# Altium schematic sheet Power.SchDoc: Power
size A3; Author: Silard Gal; SheetNumber: 3; SheetTotal: 7
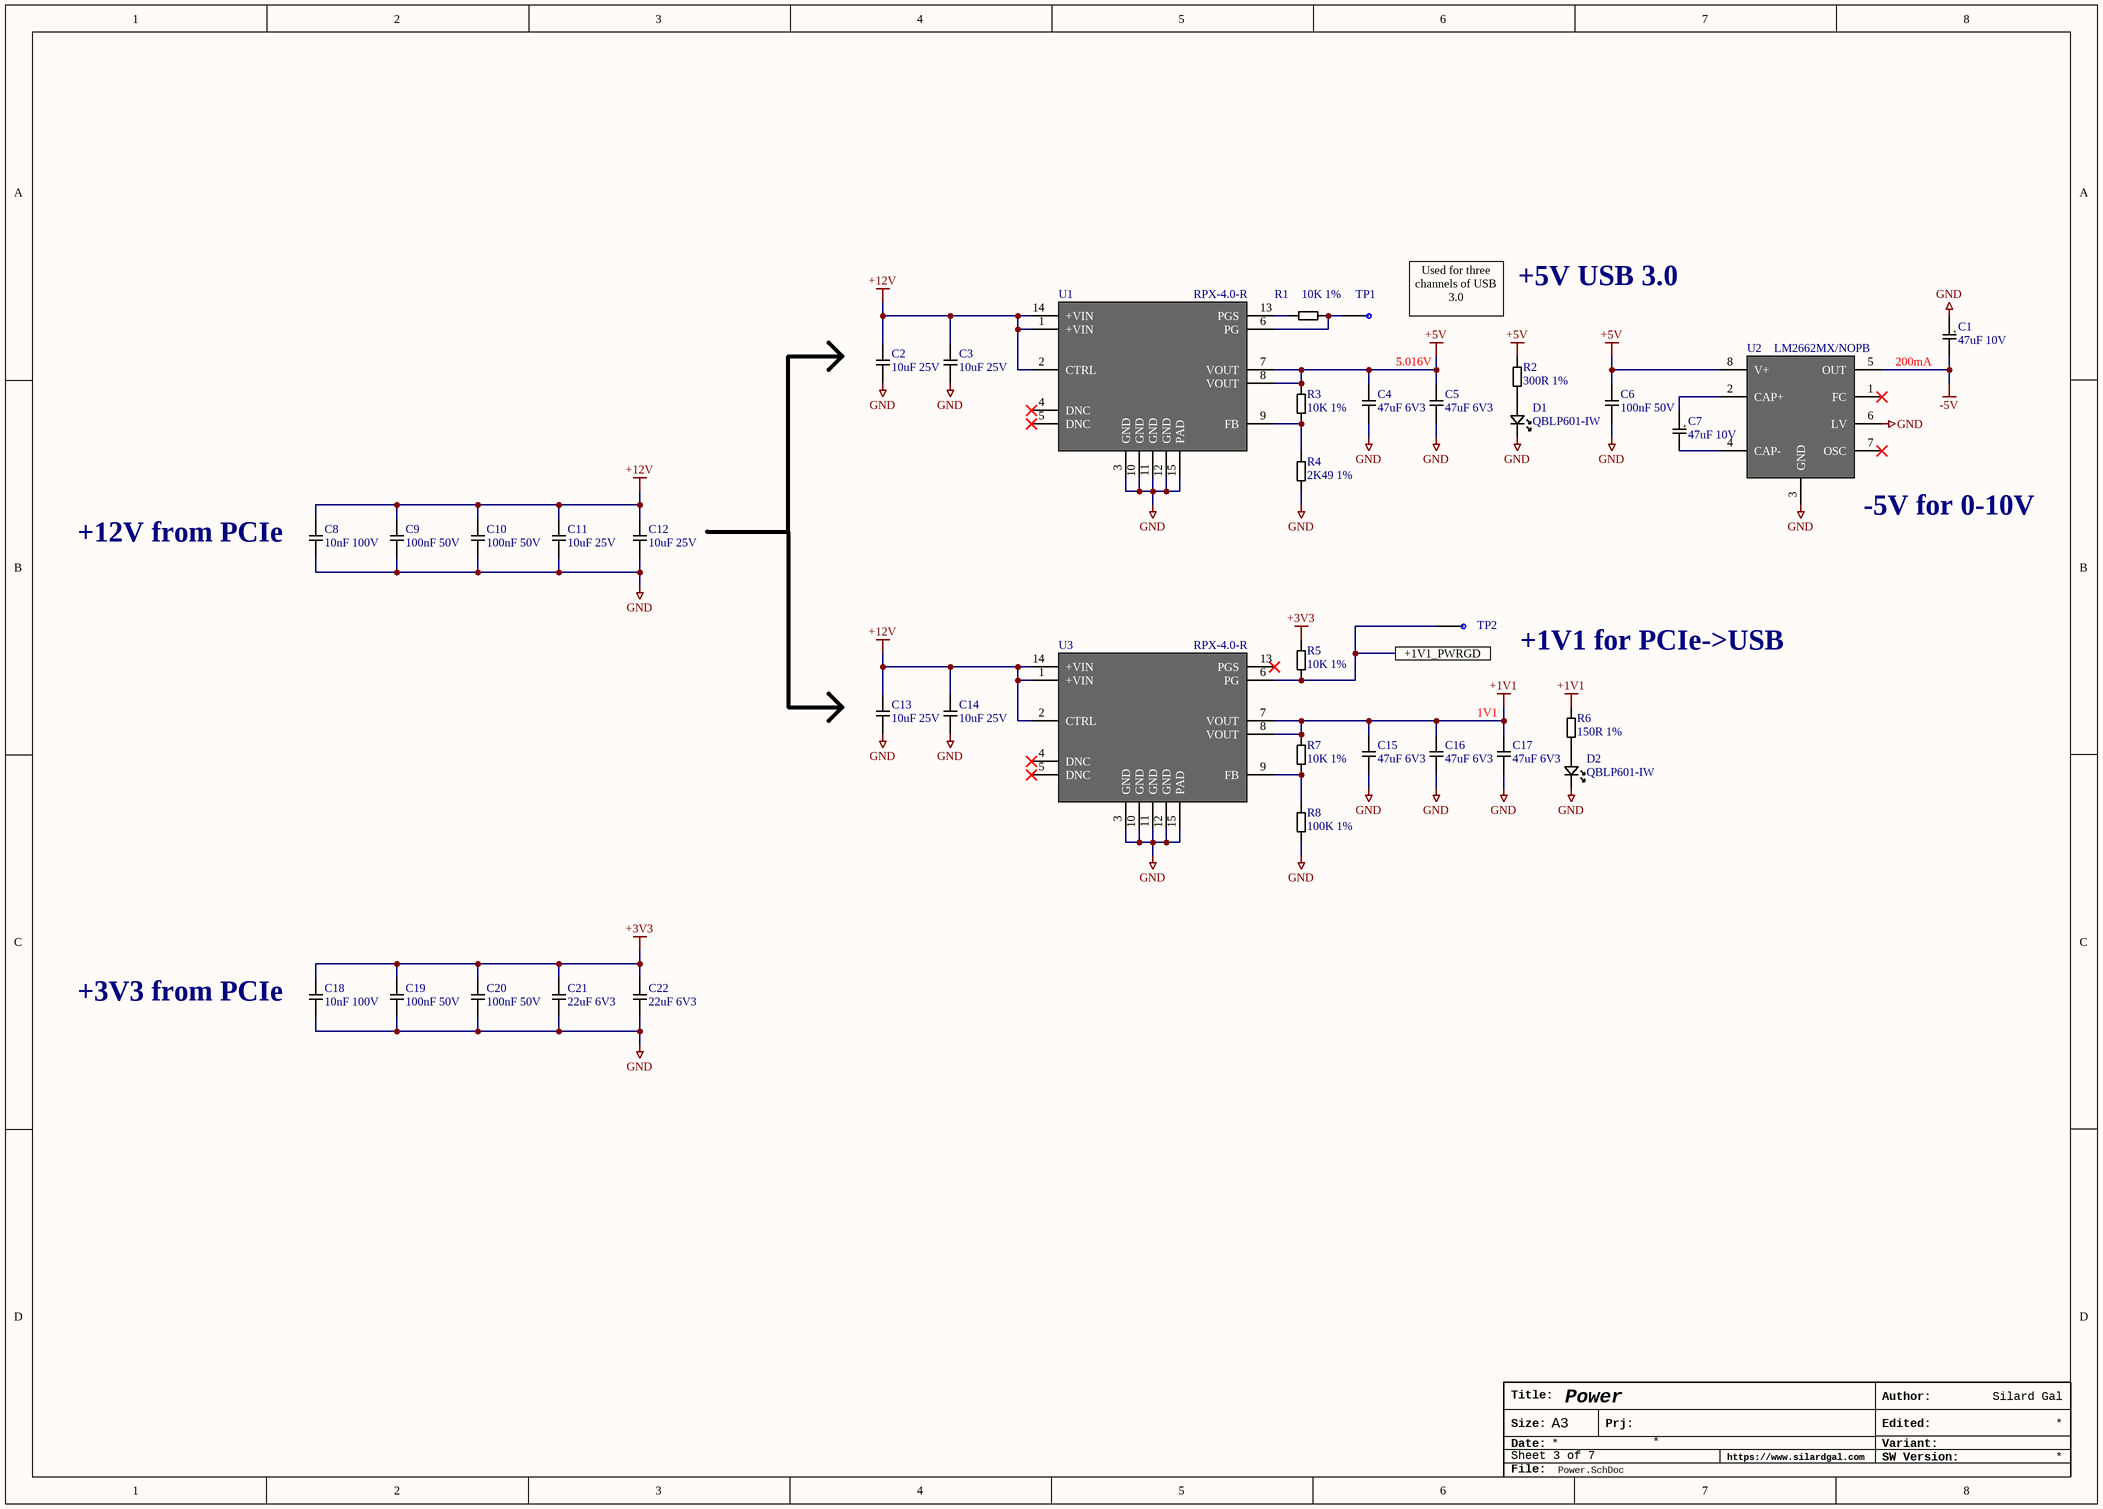
[diagram p0: Power.SchDoc]

## Parts
C1  47uF 10V  [293D476X9010B2TE3]
C2  10uF 25V  [CAPC1608X06N]
C3  10uF 25V  [CAPC1608X06N]
C4  47uF 6V3  [CAPC1608X06N]
C5  47uF 6V3  [CAPC1608X06N]
C6  100nF 50V  [CAPC1608X06N]
C7  47uF 10V  [293D476X9010B2TE3]
C8  10nF 100V  [CAPC1608X06N]
C9  100nF 50V  [CAPC1608X06N]
C10  100nF 50V  [CAPC1608X06N]
C11  10uF 25V  [CAPC1608X06N]
C12  10uF 25V  [CAPC1608X06N]
C13  10uF 25V  [CAPC1608X06N]
C14  10uF 25V  [CAPC1608X06N]
C15  47uF 6V3  [CAPC1608X06N]
C16  47uF 6V3  [CAPC1608X06N]
C17  47uF 6V3  [CAPC1608X06N]
C18  10nF 100V  [CAPC1608X06N]
C19  100nF 50V  [CAPC1608X06N]
C20  100nF 50V  [CAPC1608X06N]
C21  22uF 6V3  [CAPC1608X06N]
C22  22uF 6V3  [CAPC1608X06N]
D1  QBLP601-IW  [LEDC1608X06N]
D2  QBLP601-IW  [LEDC1608X06N]
R1  10K 1%  [RESC1608X06N]
R2  300R 1%  [RESC1608X06N]
R3  10K 1%  [RESC1608X06N]
R4  2K49 1%  [RESC1608X06N]
R5  10K 1%  [RESC1608X06N]
R6  150R 1%  [RESC1608X06N]
R7  10K 1%  [RESC1608X06N]
R8  100K 1%  [RESC1608X06N]
TP1  TP  [TP]  (value not drawn)  (no BOM)
TP2  TP  [TP]  (value not drawn)  (no BOM)
U1  RPX-4.0-R  [REPC-4.0]
U2  LM2662MX/NOPB  [SOIC127P599X175-8N]
U3  RPX-4.0-R  [REPC-4.0]

## Ports
+1V1_PWRGD

## Nets
+1V1: C15.2 C16.2 C17.2 R6.2 R7.2 U3.7(VOUT) U3.8(VOUT)
+3V3: C18.2 C19.2 C20.2 C21.2 C22.2 R5.2
+5V: C4.2 C5.2 C6.2 R2.2 R3.2 U1.7(VOUT) U1.8(VOUT) U2.8(V+)
+12V: C2.2 C3.2 C8.2 C9.2 C10.2 C11.2 C12.2 C13.2 C14.2 U1.1(+VIN) U1.2(CTRL) U1.14(+VIN) U3.1(+VIN) U3.2(CTRL) U3.14(+VIN)
-5V: C1.2 U2.5(OUT)
GND: C1.1 C2.1 C3.1 C4.1 C5.1 C6.1 C8.1 C9.1 C10.1 C11.1 C12.1 C13.1 C14.1 C15.1 C16.1 C17.1 C18.1 C19.1 C20.1 C21.1 C22.1 D1.2 D2.2 R4.1 R8.1 U1.3(GND) U1.10(GND) U1.11(GND) U1.12(GND) U1.15(PAD) U2.3(GND) U2.6(LV) U3.3(GND) U3.10(GND) U3.11(GND) U3.12(GND) U3.15(PAD)
+1V1_PWRGD: R5.1 TP2.1 U3.6(PG) ; port +1V1_PWRGD
NetC7_1: C7.1 U2.2(CAP+)
NetC7_2: C7.2 U2.4(CAP-)
NetD1_1: D1.1 R2.1
NetD2_1: D2.1 R6.1
NetR1_1: R1.1 U1.13(PGS)
NetR1_2: R1.2 TP1.1 U1.6(PG)
NetR3_1: R3.1 R4.2 U1.9(FB)
NetR7_1: R7.1 R8.2 U3.9(FB)

Not connected (* = marked no-connect by the designer): U1 4(DNC)* 5(DNC)*; U2 1(FC)* 7(OSC)*; U3 4(DNC)* 5(DNC)* 13(PGS)*

## Notes on the sheet
- Used for three channels of USB 3.0
- +5V USB 3.0
- 5.016V
- 200mA
- (near U2) -5V for 0-10V
- (near C8) +12V from PCIe
- +1V1 for PCIe->USB
- (near C17) 1V1
- (near C18) +3V3 from PCIe
- Title:
- Author:
- Size:
- Date:
- A3
- Prj:
- https://www.silardgal.com
- SW Version:
- Variant:
- Edited:
- File:
- (in symbol 47uF 10V) +

## Library data of the parts
C1 C7 = 47uF 10V: 47 µF Molded Tantalum Capacitors 10 V 1411 (3528 Metric) 1.8Ohm; MPN: 293D476X9010B2TE3
C2 C3 C11-C14 = 10uF 25V: 10 µF ±20% 25V Ceramic Capacitor X5R 0603 (1608 Metric); MPN: GRM188R61E106MA73D
C4 C5 C15-C17 = 47uF 6V3: 10 µF ±20% 25V Ceramic Capacitor X5R 0603 (1608 Metric); MPN: GRM188R60J476ME15D
C6 C9 C10 C19 C20 = 100nF 50V: 0.1 µF ±10% 50V Ceramic Capacitor X7R 0603 (1608 Metric); MPN: GCM188R71H104KA57D
C8 C18 = 10nF 100V: 10000 pF ±10% 100V Ceramic Capacitor X7R 0603 (1608 Metric); MPN: GCM188R72A103KA37D
C21 C22 = 22uF 6V3: 22 µF ±20% 6.3V Ceramic Capacitor X5R 0603 (1608 Metric); MPN: GRM188R60J226MEA0D
D1 D2 = LED WHITE: White LED Indication - Discrete 3.2V 0603 (1608 Metric); MPN: QBLP601-IW
R1 R3 R5 R7 = 10K 1%: 10 kOhms ±1% 0.1W, 1/10W Chip Resistor 0603 (1608 Metric) Automotive AEC-Q200 Thick Film; MPN: ERJ-3EKF1002V
R2 = 300R 1%: 300 Ohms ±1% 0.1W, 1/10W Chip Resistor 0603 (1608 Metric) Automotive AEC-Q200 Thick Film; MPN: ERJ-3EKF3000V
R4 = 2K49 1%: 2.49 kOhms ±1% 0.1W, 1/10W Chip Resistor 0603 (1608 Metric) Automotive AEC-Q200 Thick Film; MPN: RMCF0603FT2K49
R6 = 150R 1%: 150 Ohms ±1% 0.1W, 1/10W Chip Resistor 0603 (1608 Metric) Automotive AEC-Q200 Thick Film; MPN: ERJ-3EKF1500V
R8 = 100K 1%: 100 kOhms ±1% 0.1W, 1/10W Chip Resistor 0603 (1608 Metric) Moisture Resistant Thick Film; MPN: RC0603FR-07100KL
U1 U3 = RPX-4.0-R: Non-Isolated PoL Module DC DC Converter 1 Output 1 ~ 7V 4A 3.8V - 36V Input; MPN: RPX-4.0-R
U2 = LM2662MX/NOPB: Switching Voltage Regulators Switched Capacitor Vtg Cnvtr; MPN: LM2662MX/NOPB